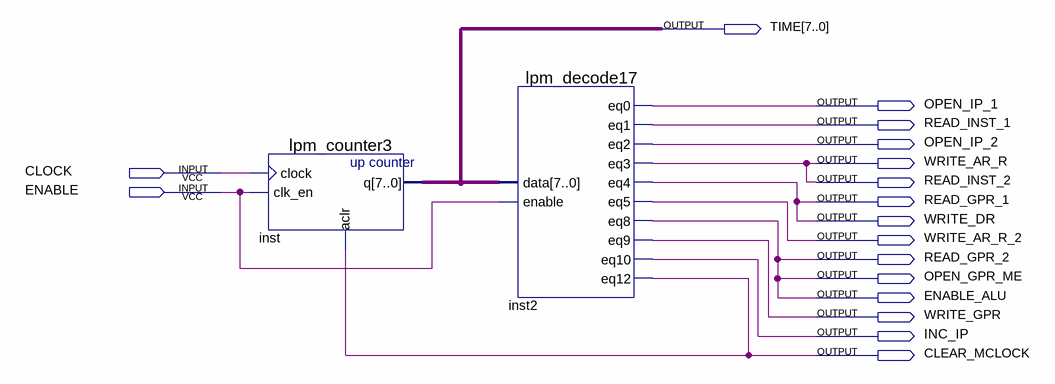
[diagram p0: schematic sheet]
// Quartus schematic NAND_REG_REG.bdf as structural Verilog: 2 symbols, 17 pins
module NAND_REG_REG (
  input  CLOCK,
  input  ENABLE,
  output [7:0] TIME,
  output OPEN_IP_1,
  output READ_INST_1,
  output OPEN_IP_2,
  output WRITE_AR_R,
  output READ_INST_2,
  output READ_GPR_1,
  output WRITE_DR,
  output WRITE_AR_R_2,
  output READ_GPR_2,
  output OPEN_GPR_ME,
  output ENABLE_ALU,
  output WRITE_GPR,
  output INC_IP,
  output CLEAR_MCLOCK
);

  lpm_counter3 inst (.clock(CLOCK), .clk_en(ENABLE), .aclr(CLEAR_MCLOCK), .q(TIME));
  lpm_decode17 inst2 (
    .data(TIME), .enable(ENABLE), .eq0(OPEN_IP_1), .eq1(READ_INST_1), .eq2(OPEN_IP_2), .eq3(READ_INST_2),
    .eq4(READ_GPR_1), .eq5(WRITE_AR_R_2), .eq8(ENABLE_ALU), .eq9(WRITE_GPR), .eq10(INC_IP),
    .eq12(CLEAR_MCLOCK));

  assign OPEN_GPR_ME = ENABLE_ALU;
  assign READ_GPR_2 = ENABLE_ALU;
  assign WRITE_AR_R = READ_INST_2;
  assign WRITE_DR = READ_GPR_1;
endmodule
